# EAGLE design Astromereni_05 (EAGLE 9.6.2)
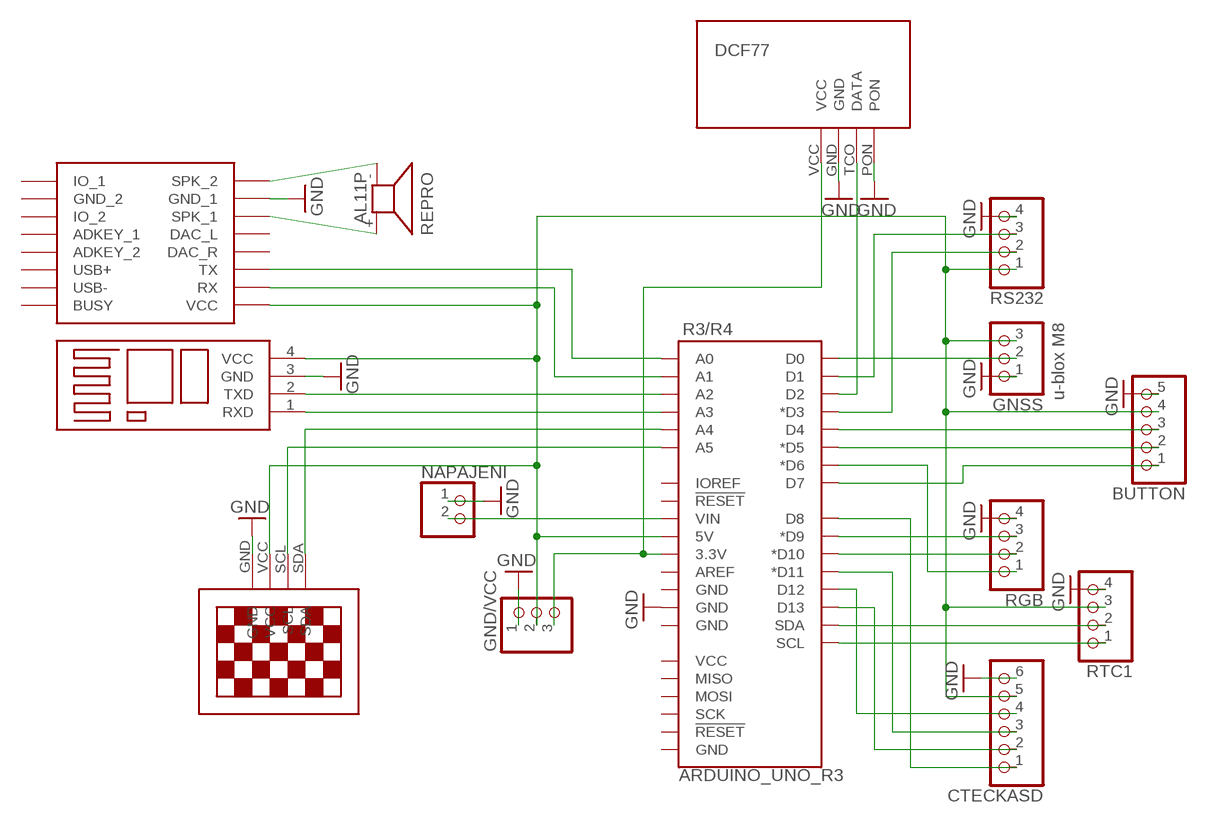
[diagram p0: schematic, sheet 1]

## Parts
B4  BLUETOOTH  [BLUETOOTH]
BUTTON  PINHD-1X5  [1X05]
CTECKASD  PINHD-1X6  [1X06]
GND/VCC  PINHD-1X3  [1X03]
GNSS  PINHD-1X3  [1X03]
NAPAJENI  PINHD-1X2  [1X02]
R3/R4  ARDUINO_UNO_R3  [ARDUINO_R3]
REPRO  AL11P  [AL11P]
RGB  PINHD-1X4  [1X04]
RS232  PINHD-1X4  [1X04]
RTC1  PINHD-1X4  [1X04]
U$3  DFPLAYER  [DFPLAYER]
U$5  13"OLED13"OLED  [1.3"OLED]
U$6  DCF77  [DCF77]

## Nets
GND: B4.3(GND) BUTTON.5 CTECKASD.6 GND/VCC.1 GNSS.1 NAPAJENI.1 R3/R4.GND@3(GND) RGB.4 RS232.4 RTC1.4 U$3.GND_1 U$5.GND U$6.GND U$6.PON
N$1: CTECKASD.3 R3/R4.D11(*D11)
N$2: R3/R4.D6(*D6) RGB.1
N$3: BUTTON.1 R3/R4.D7
N$4: R3/R4.SDA RTC1.2
N$5: R3/R4.SCL RTC1.1
N$6: GND/VCC.3 R3/R4.3.3V U$6.VCC
N$7: CTECKASD.1 R3/R4.D8
N$8: CTECKASD.4 R3/R4.D12
N$25: R3/R4.A5 U$5.SCL
N$26: R3/R4.A4 U$5.SDA
N$27: GNSS.2 R3/R4.D0
N$28: REPRO.+ U$3.SPK1(SPK_1)
N$29: REPRO.- U$3.SPK2(SPK_2)
N$30: B4.2(TXD) R3/R4.A2
N$31: B4.1(RXD) R3/R4.A3
N$32: R3/R4.D1 RS232.3
N$34: NAPAJENI.2 R3/R4.VIN
N$36: R3/R4.D10(*D10) RGB.2
N$37: R3/R4.D9(*D9) RGB.3
N$38: R3/R4.A1 U$3.RX
N$39: R3/R4.A0 U$3.TX
N$40: B4.4(VCC) BUTTON.4 CTECKASD.5 GND/VCC.2 GNSS.3 R3/R4.5V RS232.1 RTC1.3 U$3.VCC U$5.VCC
N$42: R3/R4.D2 U$6.TCO(DATA)
N$46: R3/R4.D3(*D3) RS232.2
N$47: CTECKASD.2 R3/R4.D13
N$49: BUTTON.2 R3/R4.D5(*D5)
N$50: BUTTON.3 R3/R4.D4
Unconnected: R3/R4.AREF R3/R4.GND@1(GND) R3/R4.GND@2(GND) R3/R4.GND@4(GND) R3/R4.IOREF R3/R4.MISO R3/R4.MOSI R3/R4.RESET@1(!RESET!) R3/R4.RESET@2(!RESET!) R3/R4.SCK R3/R4.VCC U$3.ADKEY1(ADKEY_1) U$3.ADKEY2(ADKEY_2) U$3.BUSY U$3.DAC_L U$3.DAC_R U$3.GND_2 U$3.IO1(IO_1) U$3.IO2(IO_2) U$3.USB+ U$3.USB-

## Notes on the sheet
- u-blox M8

## Library data of the parts
B4 = Bluetooth:BLUETOOTH
BUTTON = pinhead:PINHD-1X5: PIN HEADER
CTECKASD = pinhead:PINHD-1X6: PIN HEADER
GND/VCC GNSS = pinhead:PINHD-1X3: PIN HEADER
NAPAJENI = pinhead:PINHD-1X2: PIN HEADER
R3/R4 = SparkFun-Boards:ARDUINO_UNO_R3: Arduino R3 Footprint with SPI header Arduino Uno R3 Compatible Footprint. Matches PCB size of the original board. SparkFun Products: SAMD21 Dev Breakout <https://www.sparkfun.com/products/13672> RedBoard <https://www.sparkfun.com/products/12757> R3 Stackable Headers <https://www.sparkfun.com/products/11417>
REPRO = buzzer:AL11P: SPEAKER Source: Buerklin; OC_FARNELL: unknown; OC_NEWARK: unknown
RGB RS232 RTC1 = pinhead:PINHD-1X4: PIN HEADER
U$3 = DFPlayer_v1:DFPLAYER
U$5 = 13oled:13"OLED
U$6 = dcf1:DCF77

## Net classes
0 default: width 0.406 mm, drill 0.406 mm

## Board
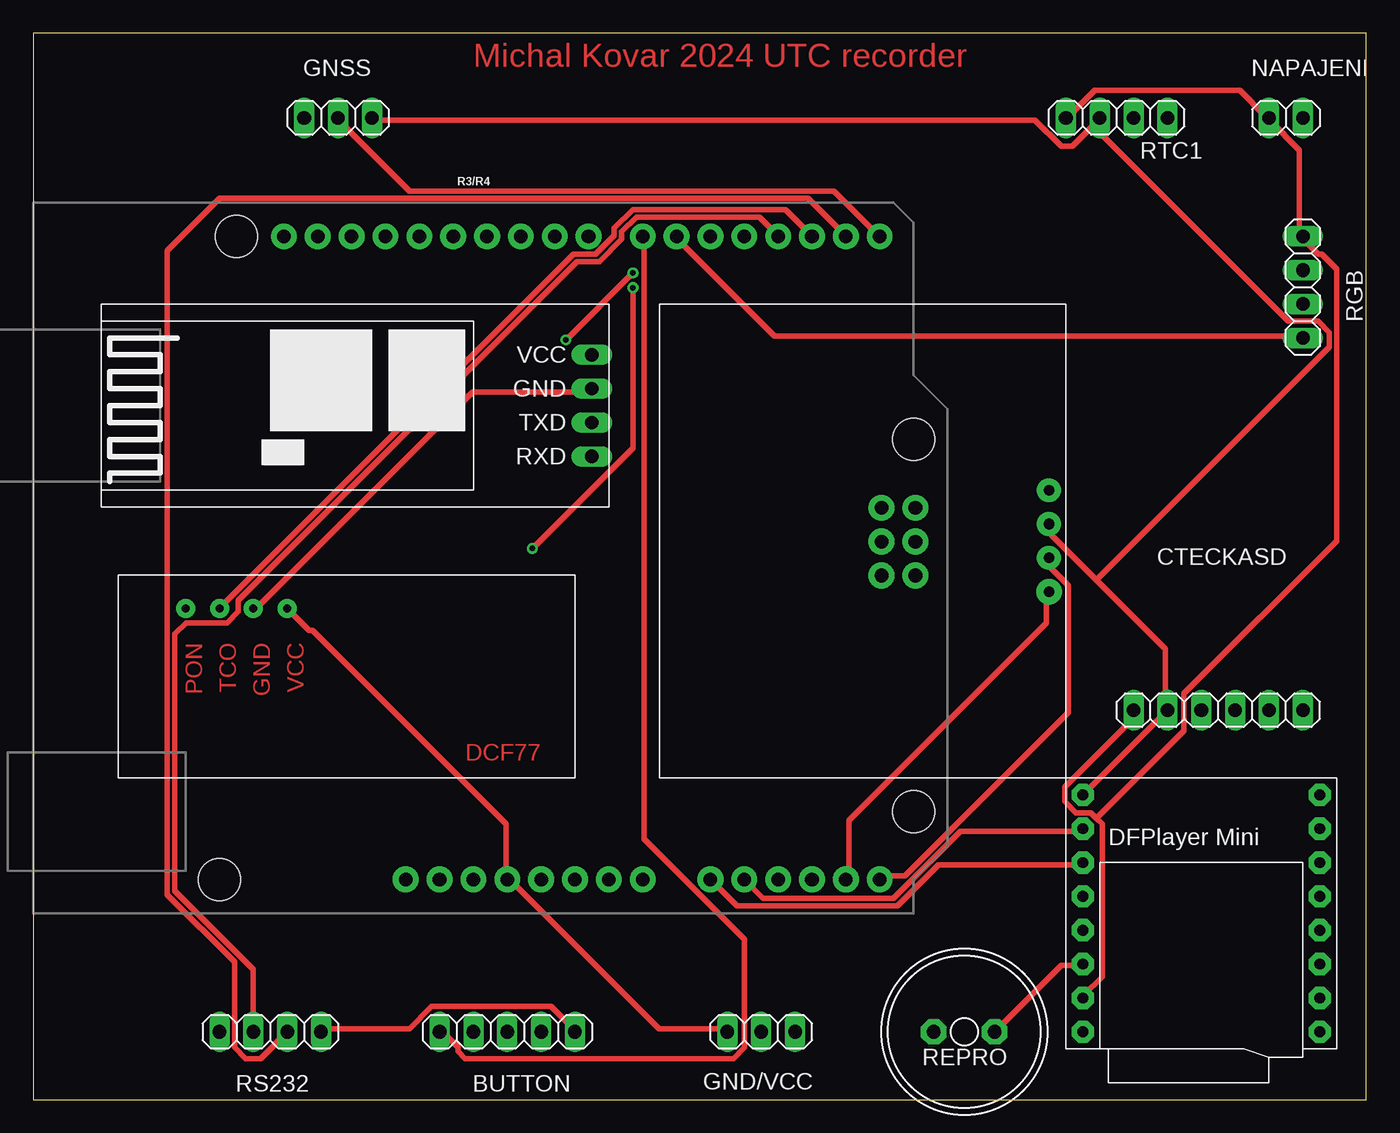
[diagram p1: board, top side]
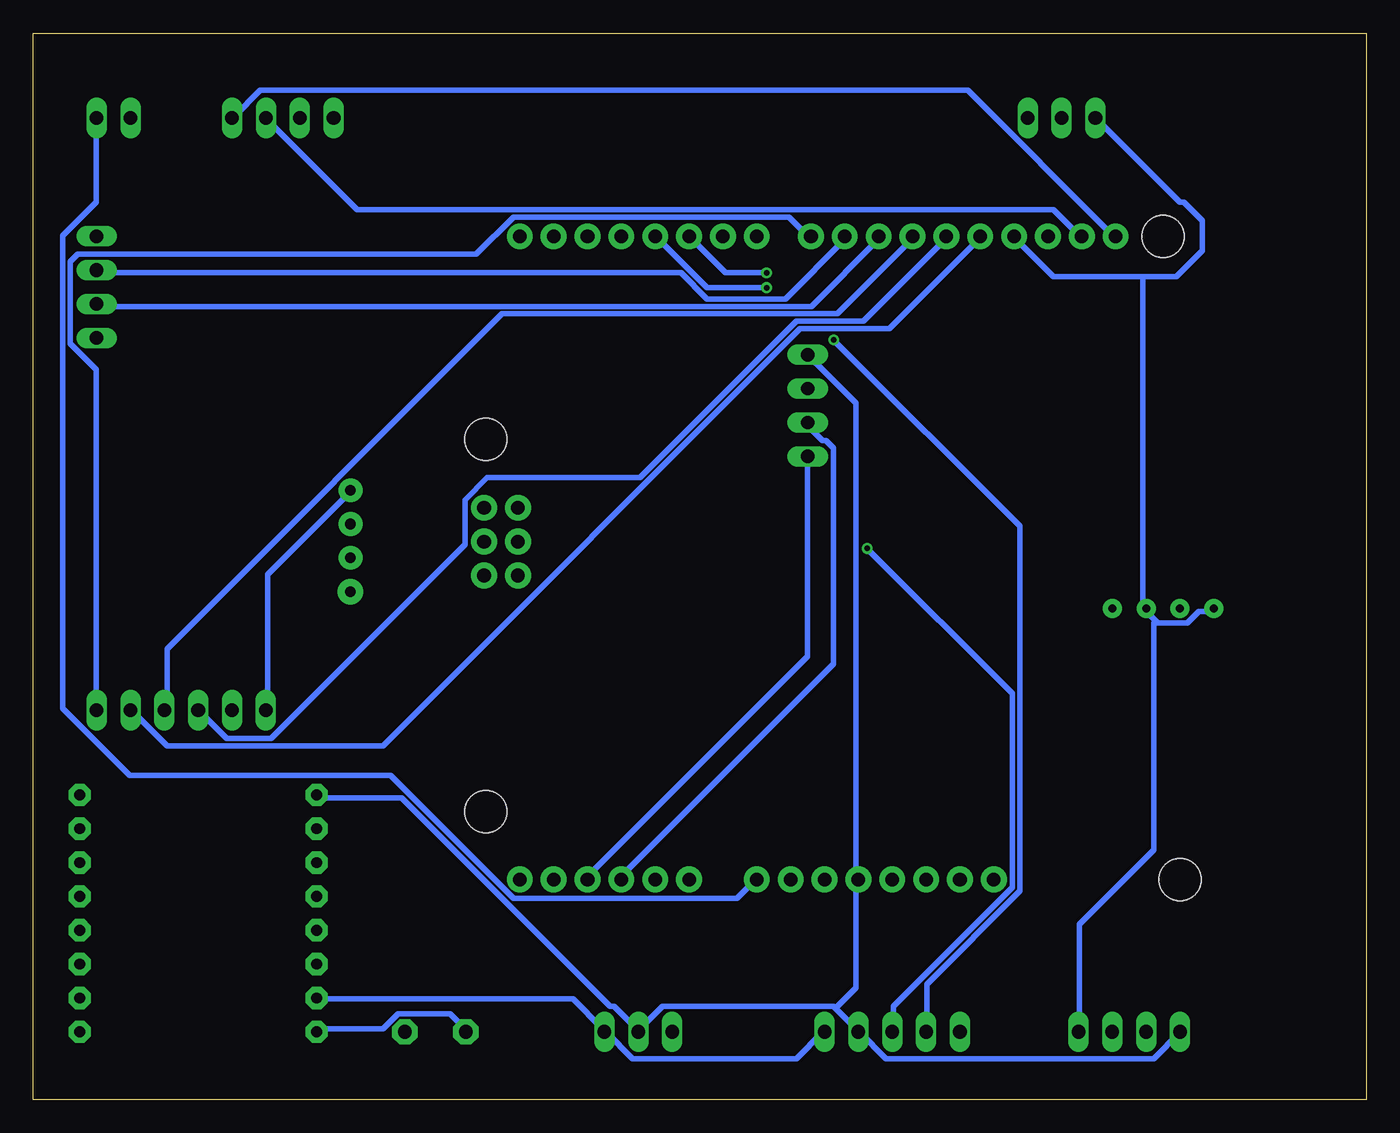
[diagram p2: board, bottom side, seen from below]

Size 100 x 80 mm. Coordinates in mm from the lower left corner, seen from the top.
Outline: 0,0 100,0 100,80 0,80 0,0
Copper layers (1*16): Top 0.035mm / dielectric 1.5mm / Bottom 0.035mm
Design rules "default": minimum track width 6mil, minimum drill 0.35mm, track to track 6mil, track to pad 6mil, pad to pad 6mil, via to via 6mil, smd to smd 6mil, copper to edge 40mil, drill to drill 6mil, minimum pad ring 10mil, minimum via ring 8mil, stop-mask expansion 4mil, vias tented up to drill 0mil, thermal gap 10mil

### Footprints (pad centres in the part's own frame; a part is rotated, then mirrored left to right if it is on the bottom)
BLUETOOTH = drill 1 pad 1.549 long: 1 -6.35,3.81; 2 -6.35,1.27; 3 -6.35,-1.27; 4 -6.35,-3.81
1X05 = drill 1.016 long: 1 -5.08,0; 2 -2.54,0; 3 0,0; 4 2.54,0; 5 5.08,0
1X06 = drill 1.016 long: 1 -6.35,0; 2 -3.81,0; 3 -1.27,0; 4 1.27,0; 5 3.81,0; 6 6.35,0
1X03 = drill 1.016 long: 1 -2.54,0; 2 0,0; 3 2.54,0
1X02 = drill 1.016 long: 1 -1.27,0; 2 1.27,0
ARDUINO_R3 = drill 1.016 pad 1.93: 3.3V 2.54,-24.13; 5V 5.08,-24.13; A0 17.78,-24.13; A1 20.32,-24.13; A2 22.86,-24.13; A3 25.4,-24.13; A4 27.94,-24.13; A5 30.48,-24.13; AREF -9.144,24.13; D0 30.48,24.13; D1 27.94,24.13; D2 25.4,24.13; D3 22.86,24.13; D4 20.32,24.13; D5 17.78,24.13; D6 15.24,24.13; D7 12.7,24.13; D8 8.636,24.13; D9 6.096,24.13; D10 3.556,24.13; D11 1.016,24.13; D12 -1.524,24.13; D13 -4.064,24.13; GND@1 7.62,-24.13; GND@2 10.16,-24.13; GND@3 -6.604,24.13; GND@4 33.16,-1.32; IOREF -2.54,-24.13; MISO 30.62,3.76; MOSI 33.16,1.22; NC -5.08,-24.13; RESET@1 0,-24.13; RESET@2 30.62,-1.32; SCK 30.62,1.22; SCL -14.224,24.13; SDA -11.684,24.13; VCC 33.16,3.76; VIN 12.7,-24.13 | hole 3.175: -17.78,24.13; 33.02,8.89; 33.02,-19.05; -19.05,-24.13
AL11P = drill 1.016 pad 1.905 octagon: + 2.286,0; - -2.286,0
1X04 = drill 1.016 long: 1 -3.81,0; 2 -1.27,0; 3 1.27,0; 4 3.81,0
DFPLAYER = drill 0.8 pad 1.676 octagon: ADKEY1 8.89,-1.27; ADKEY2 8.89,1.27; BUSY 8.89,8.89; DAC_L -8.89,-1.27; DAC_R -8.89,1.27; GND_1 -8.89,-6.35; GND_2 8.89,-6.35; IO1 8.89,-8.89; IO2 8.89,-3.81; RX -8.89,6.35; SPK1 -8.89,-3.81; SPK2 -8.89,-8.89; TX -8.89,3.81; USB+ 8.89,3.81; USB- 8.89,6.35; VCC -8.89,8.89
1.3"OLED = drill 0.8 pad 1.778: GND 0,0; SCL 5.08,0; VCC 2.54,0 | drill 0.8 pad 1.9: SDA 7.62,0
DCF77 = drill 0.6 pad 1.422: GND 24.13,2.54; PON 29.21,2.54; TCO 26.67,2.54; VCC 21.59,2.54

### Placement (x,y rotation side)
B4  35.56,52.07 180 top
BUTTON  35.56,5.08 0 top
CTECKASD  88.9,29.21 180 top
GND/VCC  54.61,5.08 180 top
GNSS  22.86,73.66 0 top
NAPAJENI  93.98,73.66 0 top
R3/R4  33.02,40.64 0 top
REPRO  69.85,5.08 0 top
RGB  95.25,60.96 90 top
RS232  17.78,5.08 0 top
RTC1  81.28,73.66 180 top
U$3  87.63,13.97 0 top
U$5  76.2,45.72 270 top
U$6  40.64,39.37 180 top

### Tracks (layer width: path | path; a pad name or v marks a point on that pad's centre or on a via)
GND
  Top 0.406: B4.3 41.91,53.09 32.97,53.09 16.76,36.88 U$6.GND | RTC1.4 77.67,73.76 79.63,75.72 90.53,75.72 92.48,73.76 NAPAJENI.1 92.76,73.48 95,71.25 95,64.82 RGB.4 95.28,64.54 96.39,63.42 96.67,63.42 97.79,62.31 97.79,41.91 86.33,30.45 86.33,27.66 79.77,21.09 | RS232.4 21.79,5.31 28.22,5.31 29.9,6.99 38.84,6.99 40.51,5.31 BUTTON.5 | 79.77,21.09 80.19,20.68 80.19,9.22 78.79,7.82 U$3.GND_1 | 79.77,21.09 79.35,21.51 78.23,21.51 77.39,22.35 77.39,23.47 82.42,28.5 82.42,29.06 CTECKASD.6
  Bottom 0.406: 16.76,61.75 23.47,61.75 26.26,64.54 R3/R4.GND@3 | 16.76,61.75 14.25,61.75 12.29,63.7 12.29,65.94 13.69,67.33 13.97,67.33 20.12,73.48 GNSS.1 | 15.79,35.9 16.48,36.6 U$6.GND 16.76,36.88 16.76,61.75 | 15.79,35.9 15.65,35.76 13.41,35.76 12.57,36.6 11.46,36.6 U$6.PON | CTECKASD.6 82.42,29.34 82.42,39.4 76.28,45.54 U$5.GND | BUTTON.5 40.79,5.03 42.75,3.07 55.04,3.07 57,5.03 GND/VCC.1 57.28,5.31 59.51,7.54 78.51,7.54 U$3.GND_1 | 15.79,35.9 15.93,35.76 15.93,18.72 21.51,13.13 21.51,5.31 RS232.4
N$1
  Bottom 0.406: CTECKASD.3 89.97,29.34 89.97,33.81 64.82,58.95 39.67,58.95 34.09,64.54 R3/R4.D11
N$2
  Top 0.406: RGB.1 95,57.28 55.6,57.28 48.34,64.54 R3/R4.D6
N$3
  Top 0.406: BUTTON.1 30.73,5.03 31.85,3.91 31.85,3.63 32.41,3.07 52.53,3.07 53.37,3.91 53.37,12.01 45.82,19.56 45.82,64.54 R3/R4.D7
N$4
  Bottom 0.406: RTC1.2 82.42,73.48 75.72,66.78 23.47,66.78 21.51,64.82 R3/R4.SDA
N$5
  Bottom 0.406: RTC1.1 84.94,73.76 82.98,75.72 29.9,75.72 19,64.82 R3/R4.SCL
N$6
  Top 0.406: U$6.VCC 20.68,35.2 20.95,35.2 35.48,20.68 35.48,16.76 R3/R4.3.3V 35.76,16.48 46.94,5.31 51.97,5.31 GND/VCC.3
N$7
  Bottom 0.406: CTECKASD.1 95.28,29.34 95.28,54.76 97.23,56.72 97.23,62.87 96.67,63.42 66.78,63.42 63.98,66.22 43.31,66.22 41.91,64.82 R3/R4.D8
N$8
  Bottom 0.406: CTECKASD.4 87.45,29.06 85.5,27.1 82.14,27.1 67.61,41.63 67.61,44.98 65.94,46.66 54.48,46.66 42.75,58.4 37.72,58.4 31.57,64.54 R3/R4.D12
N$25
  Top 0.406: U$5.SCL 76.28,40.51 76.28,39.95 77.67,38.56 77.67,29.06 65.38,16.76 63.7,16.76 R3/R4.A5
N$26
  Top 0.406: U$5.SDA 76,38 76,35.76 61.19,20.95 61.19,16.76 R3/R4.A4
N$27
  Top 0.406: GNSS.2 22.91,73.48 28.22,68.17 60.07,68.17 63.42,64.82 R3/R4.D0
N$28
  Top 0.406: REPRO.+ 77.11,10.06 78.51,10.06 U$3.SPK1
N$29
  Bottom 0.406: U$3.SPK2 78.51,5.31 73.76,5.31 72.64,6.43 68.73,6.43 67.61,5.31 REPRO.-
N$30
  Bottom 0.406: B4.2 41.91,50.57 40.79,49.45 40.51,49.45 39.95,48.9 39.95,32.69 55.88,16.76 R3/R4.A2
N$31
  Bottom 0.406: B4.1 41.91,33.25 58.4,16.76 R3/R4.A3
N$32
  Top 0.406: RS232.3 17.04,3.07 15.93,3.07 15.09,3.91 15.09,10.34 10.06,15.37 10.06,63.7 13.97,67.61 58.12,67.61 R3/R4.D1
N$34
  Bottom 0.406: NAPAJENI.2 95.28,73.48 95.28,67.33 97.79,64.82 97.79,29.34 92.76,24.31 73.2,24.31 63.98,15.09 47.22,15.09 45.82,16.48 R3/R4.VIN
N$36
  Bottom 0.406: RGB.2 95,59.51 41.63,59.51 36.6,64.54 R3/R4.D10
N$37
  Bottom 0.406: RGB.3 95,62.03 51.41,62.03 49.45,60.07 43.59,60.07 39.12,64.54 R3/R4.D9
N$38
  Top 0.406: R3/R4.A1 54.76,15.09 64.54,15.09 69.57,20.12 78.51,20.12 U$3.RX
N$39
  Top 0.406: U$3.TX 78.51,17.6 67.89,17.6 64.82,14.53 52.81,14.53 50.85,16.48 R3/R4.A0
N$40
  Top 0.406: GNSS.3 25.43,73.48 75.16,73.48 77.11,71.53 77.95,71.53 79.91,73.48 RTC1.3 79.63,72.92 94.16,58.4 96.39,58.4 97.23,57.56 97.23,56.44 79.77,38.98 | U$3.VCC CTECKASD.5 84.94,29.34 84.94,33.81 79.77,38.98 | 79.77,38.98 76.28,42.47 76.28,43.03 U$5.VCC
  Bottom 0.406: B4.4 38.28,52.25 38.28,16.76 R3/R4.5V 38.28,16.48 38.28,8.38 39.81,6.84 | RS232.1 13.97,5.03 15.93,3.07 36.04,3.07 38,5.03 BUTTON.4 38.28,5.31 39.81,6.84 | 39.81,6.84 39.95,6.99 52.81,6.99 54.48,5.31 GND/VCC.2 54.76,5.31 56.44,6.99 56.72,6.99 72.36,22.63 78.51,22.63 U$3.VCC
N$42
  Top 0.406: U$6.TCO 13.97,36.88 40.51,63.42 42.19,63.42 43.59,64.82 43.59,65.38 44.98,66.78 56.44,66.78 58.4,64.82 R3/R4.D2
N$46
  Top 0.406: RS232.2 16.48,5.31 16.48,9.78 10.62,15.65 10.62,34.92 11.46,35.76 14.53,35.76 15.37,36.6 15.37,37.44 40.79,62.87 42.47,62.87 44.15,64.54 44.15,65.1 45.26,66.22 54.48,66.22 55.88,64.82 R3/R4.D3
N$47
  Bottom 0.406: CTECKASD.2 92.48,29.06 89.97,26.54 73.76,26.54 42.47,57.84 35.76,57.84 29.06,64.54 R3/R4.D13
N$49  (via drill 0.41)
  Top 0.406: v44.98,62.03 v39.95,57
  Bottom 0.406: v39.95,57 25.98,43.03 25.98,15.65 32.97,8.66 32.97,5.31 BUTTON.2 | v44.98,62.03 48.06,62.03 R3/R4.D5
N$50  (via drill 0.41)
  Top 0.406: v37.44,41.35 44.98,48.9 v44.98,60.91
  Bottom 0.406: v37.44,41.35 26.54,30.45 26.54,15.93 35.48,6.99 35.48,5.31 BUTTON.3 | v44.98,60.91 49.45,60.91 53.09,64.54 R3/R4.D4

### Text on the board
Top: Michal Kovar 2024 UTC recorder